# EAGLE design relay_pwm (EAGLE 6.4)
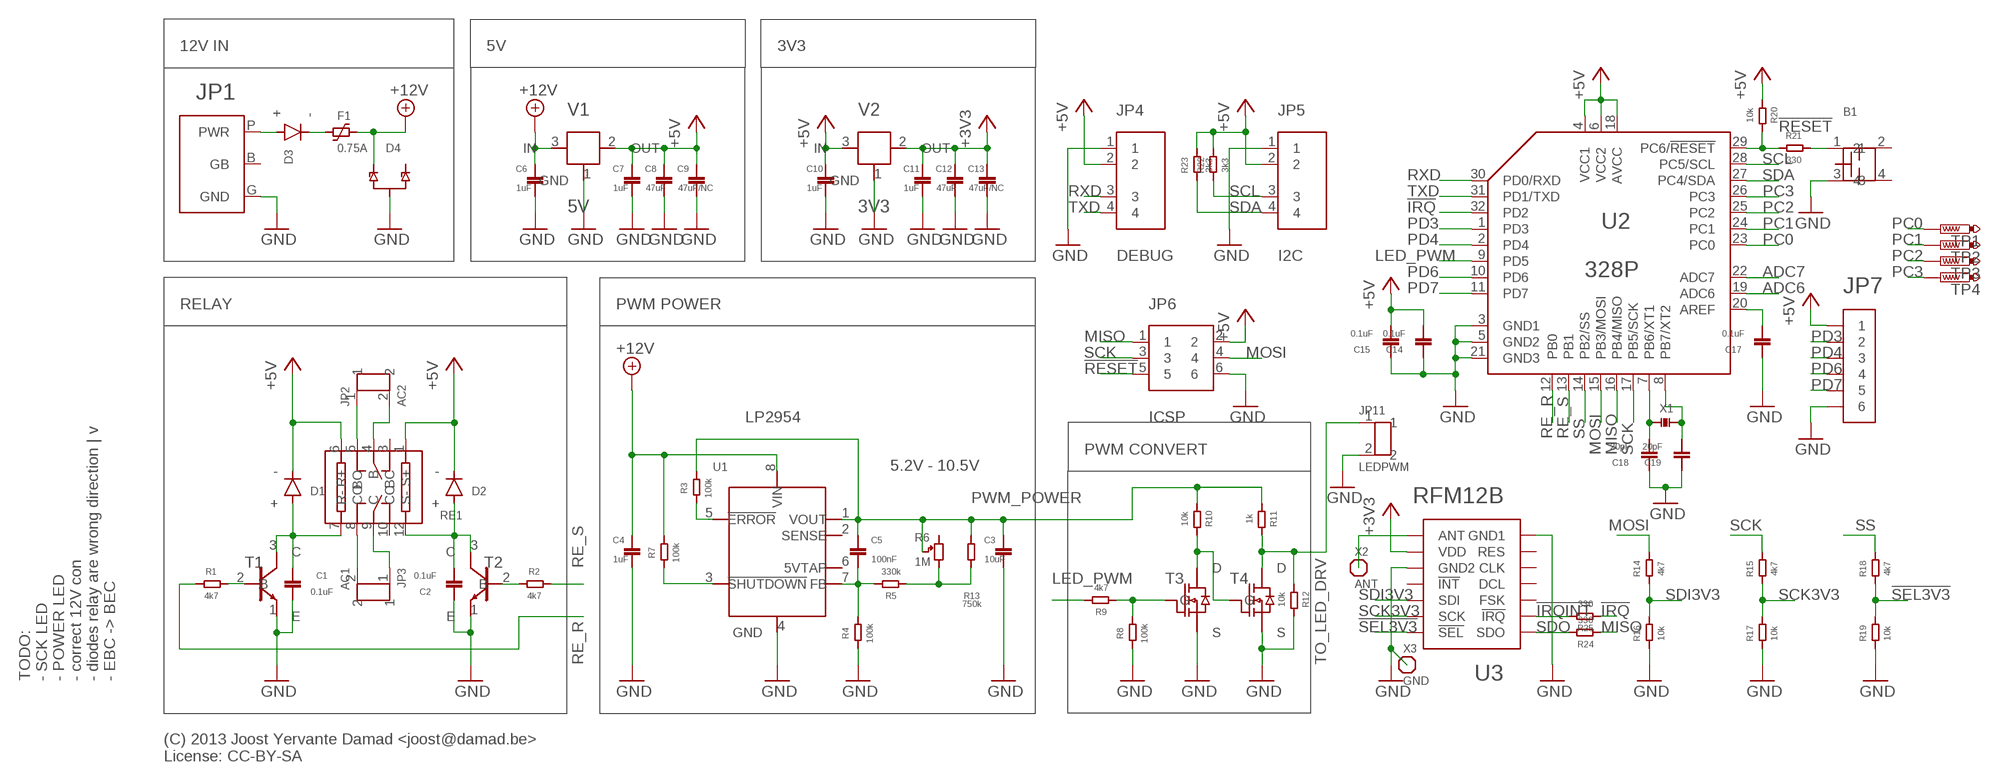
[diagram p0: schematic, sheet 1]

## Parts
B1  BUTTON_ALPS_5.2MM_SMD  [BUTTON_ALPS_SMD_5.2MM_SKQG]
C1  0.1uF  C0603  [0603@1]
C2  0.1uF  C0603  [0603@1]
C3  10uF  CAPACITOR1206  [1206]
C4  1uF  CAPACITOR0603  [0603]
C5  100nF  CAPACITOR0603  [0603]
C6  1uF  CAPACITOR0603  [0603]
C7  1uF  CAPACITOR0603  [0603]
C8  47uF  CAPACITOR1206  [1206]
C9  47uF/NC  CAPACITOR1206  [1206]
C10  1uF  CAPACITOR0603  [0603]
C11  1uF  CAPACITOR0603  [0603]
C12  47uF  CAPACITOR1206  [1206]
C13  47uF/NC  CAPACITOR1206  [1206]
C14  0.1uF  C0603  [0603@1]
C15  0.1uF  C0603  [0603@1]
C17  0.1uF  C0603  [0603@1]
C18  20pF  C0603  [0603@1]
C19  20pF  C0603  [0603@1]
D1  DIODE  [TAIW_SEM_DIODE]
D2  DIODE  [TAIW_SEM_DIODE]
D3  DIODE  [TAIW_SEM_DIODE]
D4  DUAL_TVSSOT-23  [SOT-23]
F1  0.75A  TE_POLYFUSE_1812  [TE_POLYFUSE_1812]
JP1  POWER_PLUG_2.1MM  [POWER_PLUG_2.1MM]
JP2  AC2  WAGO500-2PIN  [WAGO_500_SCREW_TERMINAL_2_PIN]
JP3  AC1  WAGO500-2PIN  [WAGO_500_SCREW_TERMINAL_2_PIN]
JP4  DEBUG  PIN1X4PTH2.54  [PIN_1X4]
JP5  I2C  PIN1X4JSTSIDE  [JST-S-4B-XH-A]
JP6  ICSP  PIN2X32X3ALT  [PIN_2X3_ALT]
JP7  PIN1X6  [PIN_1X6]
JP11  LEDPWM  WAGO500-2PIN  [WAGO_500_SCREW_TERMINAL_2_PIN]
R1  4k7  RESISTOR0603  [0603]
R2  4k7  RESISTOR0603  [0603]
R3  100k  RESISTOR0603  [0603]
R4  100k  RESISTOR0603  [0603]
R5  330k  RESISTOR0603  [0603]
R6  1M  TRIMMER  [SMT_TRIMMER_PANASONIC_EVM3Y]
R7  100k  RESISTOR0603  [0603]
R8  100k  RESISTOR0603  [0603]
R9  4k7  RESISTOR0603  [0603]
R10  10k  RESISTOR0603  [0603]
R11  1k  RESISTOR0603  [0603]
R12  10k  RESISTOR0603  [0603]
R13  750k  RESISTOR0603  [0603]
R14  4k7  RESISTOR0603  [0603]
R15  4k7  RESISTOR0603  [0603]
R16  10k  RESISTOR0603  [0603]
R17  10k  RESISTOR0603  [0603]
R18  4k7  RESISTOR0603  [0603]
R19  10k  RESISTOR0603  [0603]
R20  10k  RESISTOR0603  [0603]
R21  330  RESISTOR0603  [0603]
R22  3k3  RESISTOR0603  [0603]
R23  3k3  RESISTOR0603  [0603]
R24  330  RESISTOR0603  [0603]
R25  330  RESISTOR0603  [0603]
RE1  RELAY_TE_V23079_THT_STD_2C  [RELAY_TE_V23079_THT_STANDARD_BISTABLE_2_COIL]
T1  TRANSISTOR-BJT-NPNEBC  [SOT-23]
T2  TRANSISTOR-BJT-NPNEBC  [SOT-23]
T3  MOSFET-N-ENHGSD  [SOT-23]
T4  MOSFET-N-ENHGSD  [SOT-23]
TP1  PTR1B1,27  [B1,27]
TP2  PTR1B1,27  [B1,27]
TP3  PTR1B1,27  [B1,27]
TP4  PTR1B1,27  [B1,27]
U1  LP2954  [TI_LP2954_SO8]
U2  328P  ATMEGA328PTQFP32  [TQFP32]
U3  RFM12B  [RFM12B]
V1  5V  VREG_MCP1703  [SOT-23A]
V2  3V3  VREG_MCP1703  [SOT-23A]
X1  CRYSTAL  [CRYSTAL_2-PAD_5X3.2MM]
X2  ANT  PIN1X1  [PIN_1X1]
X3  GND  PIN1X1  [PIN_1X1]

## Nets
!IRQ: R25.1 U2.32(PD2)
!IRQINT: R25.2 U3.NIRQ(!IRQ)
!RESET: JP6.5 R20.2 R21.1 U2.29(PC6/!RESET)
!SEL3V3: R18.1 R19.2 U3.NSEL(!SEL)
+3V3: C11.2 C12.1 C13.1 U3.VDD V2.2(OUT)
+5V: C7.2 C8.1 C9.1 C10.2 C14.1 C15.1 D1.- D2.- JP4.2 JP5.2 JP6.2 JP7.1 R20.1 R22.2 R23.2 RE1.1(S+) RE1.6(R+) U2.4(VCC1) U2.6(VCC2) U2.18(AVCC) V1.2(OUT) V2.3(IN)
+12V: C4.2 C6.2 D4.1 F1.2 R7.2 U1.8(VIN) V1.3(IN)
ADC6: U2.19(ADC6)
ADC7: U2.22(ADC7)
GND: B1.3 C1.1 C2.2 C3.2 C4.1 C6.1 C7.1 C8.2 C9.2 C10.1 C11.1 C12.2 C13.2 C14.2 C15.2 C17.2 C18.2 C19.2 D4.3(G1) JP1.G(GND) JP4.1 JP5.1 JP6.6 JP7.6 JP11.2 R4.1 R8.1 R12.2 R16.1 R17.1 R19.1 T1.1(E) T2.1(E) T3.2(S) T4.2(S) U1.4(GND) U2.3(GND1) U2.5(GND2) U2.21(GND3) U3.GND@1(GND1) U3.GND@2(GND2) V1.1(GND) V2.1(GND) X3.1
LED_PWM: R9.2 U2.9(PD5)
LED_PWM_INT: R8.2 R9.1 T3.1(G)
LP2954_ER: R3.1 U1.5(!ERROR)
LP2954_FB: C5.1 R4.2 R5.2 U1.7(FB)
LP2954_SH: R7.1 U1.3(!SHUTDOWN)
MISO: JP6.1 R24.1 U2.16(PB4/MISO)
MOSI: JP6.4 R14.2 U2.15(PB3/MOSI)
N$1 [high power]: JP2.1 RE1.5(BO)
N$2 [high power]: JP2.2 RE1.4(B)
N$3 [high power]: JP3.2 RE1.8(CO)
N$4 [high power]: JP3.1 RE1.9(C)
N$7: C2.1 D2.+ RE1.12(S-) T2.3(C)
N$8: R10.2 T3.3(D) T4.1(G)
N$9: R5.1 R6.C R13.1
N$10: R2.1 T2.2(B)
N$11: D3.+ JP1.P(PWR)
N$12: D3.- F1.1
N$13: U3.ANT X2.1
N$14: C17.1 U2.20(AREF)
N$16: B1.1 R21.2
N$17: C18.1 U2.7(PB6/XT1) X1.1
N$18: C19.1 U2.8(PB7/XT2) X1.2
PC0: TP1.TP U2.23(PC0)
PC1: TP2.TP U2.24(PC1)
PC2: TP3.TP U2.25(PC2)
PC3: TP4.TP U2.26(PC3)
PD3: JP7.2 U2.1(PD3)
PD4: JP7.3 U2.2(PD4)
PD6: JP7.4 U2.10(PD6)
PD7: JP7.5 U2.11(PD7)
PWM_POWER: C3.1 C5.2 R3.2 R6.B R10.1 R11.1 R13.2 U1.1(VOUT)
RE_R: R1.1 U2.12(PB0)
RE_S: R2.2 U2.13(PB1)
RXD: JP4.3 U2.30(PD0/RXD)
SCK: JP6.3 R15.2 U2.17(PB5/SCK)
SCK3V3: R15.1 R17.2 U3.SCK
SCL: JP5.3 R22.1 U2.28(PC5/SCL)
SDA: JP5.4 R23.1 U2.27(PC4/SDA)
SDI3V3: R14.1 R16.2 U3.SDI
SDO: R24.2 U3.SDO
SS: R18.2 U2.14(PB2/SS)
T1B: R1.2 T1.2(B)
T1C: C1.2 D1.+ RE1.7(R-) T1.3(C)
TO_LED_DRV: JP11.1 R11.2 R12.1 T4.3(D)
TXD: JP4.4 U2.31(PD1/TXD)
Unconnected: B1.2 B1.4 D4.2 JP1.B(GB) R6.A RE1.3(BC) RE1.10(CC) U1.2(SENSE) U1.6(5VTAP) U3.CLK U3.DCL U3.FSK U3.NINT(!INT) U3.RES

## Notes on the sheet
- 12V IN | 5V | 3V3
- RELAY | PWM POWER
- LP2954
- PWM CONVERT
- 5.2V - 10.5V
- TODO: 
  - SCK LED
  - POWER LED
  - correct 12V con
  - diodes relay are wrong direction | v
  - EBC -> BEC
- (C) 2013 Joost Yervante Damad <joost@damad.be>
  License: CC-BY-SA

## Library data of the parts
B1 = 01jyd:BUTTON_ALPS_5.2MM_SMD
C1 C2 C14 C15 C17-C19 = 01jyd:C0603
C3-C13 = 01jyd:CAPACITOR
D1-D3 = 01jyd:DIODE
D4 = 01jyd:DUAL_TVS
F1 = 01jyd:TE_POLYFUSE_1812
JP1 = 01jyd:POWER_PLUG_2.1MM
JP2 JP3 JP11 = 01jyd:WAGO500-2PIN
JP4 JP5 = 01jyd:PIN1X4
JP6 = 01jyd:PIN2X3
JP7 = 01jyd:PIN1X6
R1-R5 R7-R25 = 01jyd:RESISTOR
R6 = 01jyd:TRIMMER
RE1 = 01jyd:RELAY_TE_V23079_THT_STD_2C
T1 T2 = 01jyd:TRANSISTOR-BJT-NPN
T3 T4 = 01jyd:MOSFET-N-ENH
TP1-TP4 = testpad:PTR1: TEST PIN
U1 = 01jyd:LP2954
U2 = 01jyd:ATMEGA328P
U3 = 01jyd:RFM12B
V1 V2 = 01jyd:VREG_MCP1703
X1 = 01jyd:CRYSTAL
X2 X3 = 01jyd:PIN1X1

## Net classes
1 high power: width 1 mm

## Board
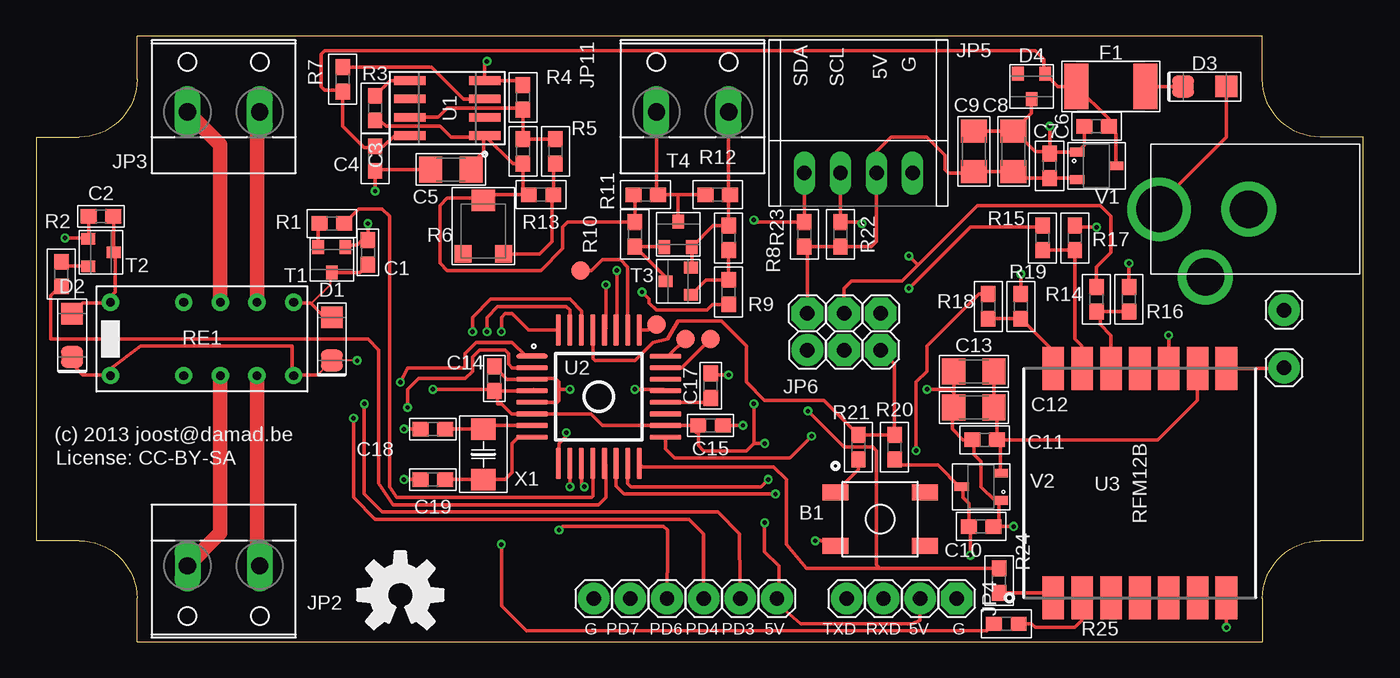
[diagram p1: board, top side]
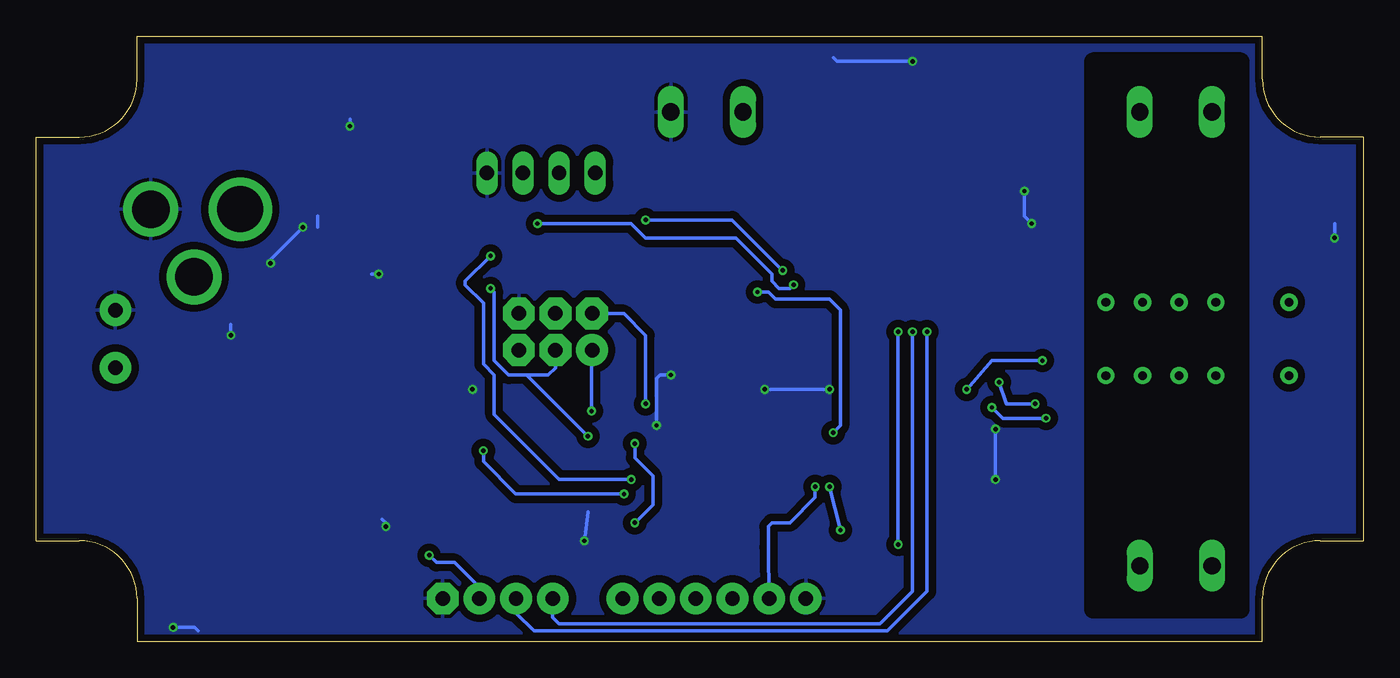
[diagram p2: board, bottom side, seen from below]

Size 92 x 42 mm. Coordinates in mm from the lower left corner, seen from the top.
Outline: 7,0 85,0 85,3 arc-90 89,7 92,7 92,35 89,35 arc-90 85,39 85,42 7,42 7,39 arc-90 3,35 0,35 0,7 3,7 arc-90 7,3 7,0
Copper layers (1*2*15*16): Top 0.035mm / dielectric 0.2mm / Route2 0.0175mm / dielectric 1.1mm / Route15 0.0175mm / dielectric 0.2mm / Bottom 0.035mm
Design rules "SeeedStudio_DRU_no_angle_20130527": minimum track width 6mil, minimum drill 12mil, track to track 6mil, track to pad 6mil, pad to pad 6mil, via to via 6mil, smd to smd 0mil, copper to edge 10mil, drill to drill 10mil, minimum pad ring 6mil, minimum via ring 6mil, stop-mask expansion 2mil, vias tented up to drill 25mil, thermal gap 10mil
bRestrict: 4 lines

### Footprints (pad centres in the part's own frame; a part is rotated, then mirrored left to right if it is on the bottom)
BUTTON_ALPS_SMD_5.2MM_SKQG = smd 1.8 x 1.1: 1 -3.1,1.85; 2 3.1,1.85; 3 -3.1,-1.85; 4 3.1,-1.85
0603@1 = smd 1.1 x 1: 1 -0.85,0; 2 0.85,0
1206 = smd 1.6 x 1.8: 1 -1.4,0; 2 1.4,0
0603 = smd 1.1 x 1: 1 -0.85,0; 2 0.85,0
TAIW_SEM_DIODE = smd 1.5 x 1.5: + 1.5,0; - -1.5,0
SOT-23 = smd 0.802 x 0.972: 1 -0.95,-0.885; 2 0.95,-0.885; 3 0,0.885
TE_POLYFUSE_1812 = smd 1.68 x 3.15: 1 -2.39,0; 2 2.39,0
POWER_PLUG_2.1MM = drill 2.6 pad 3.8: B 3.45,4.7; G 0.45,0 | drill 3.2 pad 4.4: P 6.65,0
WAGO_500_SCREW_TERMINAL_2_PIN = drill 1.2 long: 1 -2.5,-1.27; 2 2.5,-1.27
PIN_1X4 = drill 1 pad 2.2 octagon: 1 0,3.81 | drill 1 pad 2.2: 2 0,1.27; 3 0,-1.27; 4 0,-3.81
JST-S-4B-XH-A = drill 1 long: 1 3.75,0; 2 1.25,0; 3 -1.25,0; 4 -3.75,0
PIN_2X3_ALT = drill 1 pad 2.2: 1 -1.27,2.54 | drill 1 pad 2.2 octagon: 2 1.27,2.54; 3 -1.27,0; 4 1.27,0; 5 -1.27,-2.54; 6 1.27,-2.54
PIN_1X6 = drill 1 pad 2.2: 1 0,6.35; 2 0,3.81; 3 0,1.27; 4 0,-1.27; 5 0,-3.81; 6 0,-6.35
SMT_TRIMMER_PANASONIC_EVM3Y = smd 1.2 x 1.2: A -1.4,-1.6; C 1.4,-1.6 | smd 1.6 x 1.5: B 0,2.1
RELAY_TE_V23079_THT_STANDARD_BISTABLE_2_COIL = drill 0.6 pad 1.2: 1 -6.35,-2.54; 3 -1.27,-2.54; 4 1.27,-2.54; 5 3.81,-2.54; 6 6.35,-2.54; 7 6.35,2.54; 8 3.81,2.54; 9 1.27,2.54; 10 -1.27,2.54; 12 -6.35,2.54
B1,27 = smd 1.27 x 1.27: TP 0,0
TI_LP2954_SO8 = smd 2.2 x 0.6: 1 -2.6,1.905; 2 -2.6,0.635; 3 -2.6,-0.635; 4 -2.6,-1.905; 5 2.6,-1.905; 6 2.6,-0.635; 7 2.6,0.635; 8 2.6,1.905
TQFP32 = smd 2.17 x 0.36: 1 -4.625,2.8; 2 -4.625,2; 3 -4.625,1.2; 4 -4.625,0.4; 5 -4.625,-0.4; 6 -4.625,-1.2; 7 -4.625,-2; 8 -4.625,-2.8; 17 4.625,-2.8; 18 4.625,-2; 19 4.625,-1.2; 20 4.625,-0.4; 21 4.625,0.4; 22 4.625,1.2; 23 4.625,2; 24 4.625,2.8 | smd 0.36 x 2.17: 9 -2.8,-4.625; 10 -2,-4.625; 11 -1.2,-4.625; 12 -0.4,-4.625; 13 0.4,-4.625; 14 1.2,-4.625; 15 2,-4.625; 16 2.8,-4.625; 25 2.8,4.625; 26 2,4.625; 27 1.2,4.625; 28 0.4,4.625; 29 -0.4,4.625; 30 -1.2,4.625; 31 -2,4.625; 32 -2.8,4.625
RFM12B = smd 3 x 1.5: ANT 7.95,-6; CLK -7.95,-2; DCL -7.95,0; FSK -7.95,2; GND@1 -7.95,-6; GND@2 7.95,-2; NINT 7.95,0; NIRQ -7.95,4; NSEL 7.95,6; RES -7.95,-4; SCK 7.95,4; SDI 7.95,2; SDO -7.95,6; VDD 7.95,-4
SOT-23A = smd 0.6 x 1: 1 -0.95,-1.35; 2 0.95,-1.35; 3 0,1.35
CRYSTAL_2-PAD_5X3.2MM = smd 1.5 x 1.7: 1 -1.75,0; 2 1.75,0
PIN_1X1 = drill 1 pad 2.2: 1 0,0

### Placement (x,y rotation side)
B1  58.5,8.5 0 top
C1  23,27 270 top
C2  4.5,29.5 180 top
C3  28.75,32.75 180 top
C4  23.5,33.5 90 top
C5  33.75,34 270 top
C6  73.5,35.75 0 top
C7  70.25,33 270 top
C8  67.75,34 90 top
C9  65,34 90 top
C10  65.5,8 180 top
C11  65.75,14 0 top
C12  65,16.25 180 top
C13  65,18.75 180 top
C14  31.75,18.25 90 top
C15  46.75,15 0 top
C17  46.75,17.75 90 top
C18  27.5,14.75 180 top
C19  27.5,11.25 180 top
D1  20.5,21 90 top
D2  2.5,21.25 90 top
D3  81,38.5 0 top
D4  69,38.5 180 top
F1  74.5,38.5 180 top
JP1  84.5,30 180 top
JP2  13,4 180 top
JP3  13,38 0 top
JP4  60,3 270 top
JP5  57,32.5 0 top
JP6  56,21.5 90 top
JP7  45,3 270 top
JP11  45.5,38 0 top
R1  20.5,29 180 top
R2  1.75,25.5 270 top
R3  23.5,37 270 top
R4  33.75,37.75 270 top
R5  36,34 90 top
R6  31,28.5 0 top
R7  21.25,39 270 top
R8  48,28 270 top
R9  48,24.25 270 top
R10  41.5,28.25 270 top
R11  42.25,31 0 top
R12  47.25,31 0 top
R13  35,31 180 top
R14  73.5,23.75 90 top
R15  69.75,28 90 top
R16  75.75,23.75 270 top
R17  72,28 270 top
R18  66,23.25 90 top
R19  68.25,23.25 270 top
R20  59.5,13.5 90 top
R21  57,13.5 270 top
R22  55.75,28.25 270 top
R23  53.25,28.25 270 top
R24  66.75,4.25 270 top
R25  67.25,1.25 0 top
RE1  11.5,21 0 top
T1  20.5,26.5 180 top
T2  4.5,27 270 top
T3  44.5,25 90 top
T4  44.5,28.25 0 top
TP1  46.75,21 0 top
TP2  45,21 0 top
TP3  43,22 0 top
TP4  37.75,25.75 0 top
U1  28.5,37 180 top
U2  39,17 0 top
U3  76.5,11 90 top
V1  73.5,33 270 top
V2  65.5,10.75 90 top
X1  31,13 270 top
X2  86.5,19 0 top
X3  86.5,23 0 top

### Tracks (layer width: path | path; a pad name or v marks a point on that pad's centre or on a via)
!IRQ  (via drill 0.3)
  Top 0.25: U2.32 34.12,21.62 33,22.75 32.5,22.75 32.25,22.5 v32.25,21.5 | v32.25,6.75 32.25,2.5 34,0.75 65.9,0.75 R25.1
  Bottom 0.25: v32.25,21.5 v32.25,6.75
!IRQINT
  Top 0.25: R25.2 69,1.25 69.25,1 72,1 72.5,1.5 U3.NIRQ
!RESET
  Top 0.25: JP6.5 59.5,19.27 R20.2 R21.1 54.6,16.75 50.5,16.75 49.25,18 49.25,20.5 47.5,22.25 44.5,22.25 43.75,21 42.75,20.75 41.5,19.5 38.75,19.5 38.6,19.65 U2.29
!SEL3V3
  Top 0.25: U3.NSEL 70.5,20.15 R19.2 R18.1
+3V3
  Top 0.25: C11.2 77.75,14 80.5,16.75 U3.VDD | V2.2 66.85,13.75 C11.2 | C11.2 66.6,16.05 C12.1 C13.1
+5V  (via drill 0.3, 0.3 pad 0.3)
  Top 0.152: 2.5,19.25 2.5,19.62 D2.- | D1.- 19.5,18.5 | D1.- 22.12,19.5 v22.25,19.5 | D1.-
  Top 0.2: 53,1.25 52,2.1 JP7.1
  Top 0.25: 2.5,19.25 | 2.5,19.25 3.25,18.5 5.11,18.5 RE1.1 5.15,18.9 7.25,20.5 17.75,20.5 17.75,18.56 RE1.6 17.89,18.5 19.5,18.5 | 19.5,18.5 | C14.1 U2.4 34.48,17.5 | C14.1 32,17.15 32,16.5 32.25,16.5 32.95,15.8 U2.6 38.45,15.8 39.25,15 U2.18 C15.1 | V1.2 72.05,32.15 C7.2 68.2,32.15 C8.1 C9.1 64.9,32.5 63.25,32.5 63,32.75 63,33.75 61.75,35 59.25,35 58.25,34 JP5.2 58.25,27.75 57.9,27.4 R22.2 R23.2 53.46,27.19 JP6.2 53.44,22.75 | R20.1 59.9,12.25 62.5,12.25 64,10.75 V2.3 64.25,10.65 64.25,10 64.65,9.6 C10.2 64.75,7.9 v64.75,6 | 53,1.25 60.75,1.25 61.25,1.5 61.25,2.98 JP4.2 | 46,14.9 C15.1 | 31.6,17.25 C14.1 | v27.5,17.5 31.65,17.5 C14.1 | 45.75,14.5 45.75,14.85 C15.1 | C15.1 45.9,13.6 46.25,13.25 49.25,13.25 49.75,13.75 | 49.75,13.75 v49.75,16.5 | 49.75,13.75 v50.5,13.75 | v50.5,8.25 50.5,6.25 51.5,5.25 51.5,2.9 JP7.1
  Bottom 0.25: v27.5,17.5 25.75,19.5 v22.25,19.5 | JP4.2 61.27,3.77 63,5.5 64.25,5.5 v64.75,6 | v49.75,16.5 49.75,21.25 51.25,22.75 53.44,22.75 JP6.2 | v50.5,13.75 50.5,12.75 49.25,11.5 49.25,9.5 v50.5,8.25
+12V
  Top 0.2: 23.5,34.25 C4.2
  Top 0.25: U1.8 24.84,35.09 24.1,34.35 C4.2 | 23.5,34.25 22.75,34.25 21.25,35.75 R7.2 21.15,38.25 20,38.25 19.75,38.5 19.75,40.75 20,41 69.25,41 69.86,40.38 69.86,39.38 D4.1 70.83,38.5 F1.2 74.35,36.26 C6.2 74.85,35.25 V1.3
GND  (via drill 0.3, 0.3 pad 0.3)
  Top 0.25: T1.1 21.57,27.5 22.25,27.5 22.6,27.85 C1.1 v23,29 | C2.2 3.65,27.98 | 3.65,27.98 T2.1 | 3.65,27.98 2.02,27.98 v2,28 | C19.2 v25.5,11.25 | v25.5,14.75 C18.2 | C14.2 32.65,18.2 U2.3 34.42,18.25 36,18.25 36.25,18 36.25,17.5 | U2.5 36.1,16.6 36.25,16.75 36.25,17.5 | 36.25,17.5 v37,17.5 | v41.5,17.5 43.52,17.5 U2.21 | C15.2 v49,15 | v48,18.5 46.85,18.5 C17.2 | R4.1 33.45,38.91 U1.4 31.1,40.1 v31.25,40.25 | v23.5,31.25 C4.1 23.6,32.75 C3.2 | C7.1 v70.25,35.75 | C6.1 72.65,34.45 V1.1 70.35,33.95 C7.1 | C8.2 67.85,35.4 69.25,34 70.1,34 C7.1 | D4.3 69,36.65 C8.2 | C8.2 C9.2 | U3.GND@2 v78.5,21.25 | R16.1 v75.75,26.25 | v73.5,28.75 72.1,28.75 R17.1 | R19.1 v68.25,25.5 | U3.GND@1 v82.5,1 | V2.1 66.45,9.8 65.5,10.75 65.5,12.5 65,13 65,13.9 C11.1 64.25,14 63.5,14.75 63.5,16.15 C12.2 63.6,17.25 | 63.6,17.25 C13.2 | v61.75,17.5 63.35,17.5 63.6,17.25 | C10.1 66.75,8 | 66.75,8 v67.75,8 | 66.75,8 66.75,9.75 | B1.3 54.15,7.1 v54,7 | 48,31 JP11.2 | R12.2 48,31 | 48,31 R8.1 46.94,28.85 T4.2 45.45,26.02 T3.2
  Bottom 0.25: v2,28 2,29 | v25.5,11.25 v25.5,14.75 | v37,17.5 v41.5,17.5 | v49,15 49,18.25 48.75,18.5 v48,18.5 | v31.25,40.25 36.5,40.25 36.75,40.5 | v23.5,31.25 23.5,29.5 v23,29 | v70.25,35.75 70.25,36.25 | 72.5,28.75 72.5,29.5 | v78.5,21.25 78.5,22 | v75.75,26.25 75.75,26.5 v73.5,28.75 | v68.25,25.5 68.75,25.5 | v82.5,1 81,1 80.75,0.75 | v67.75,8 67.75,8.25 68,8.5 | v54,7 53.75,9
  pour Bottom (isolate 0.5): 0,42 92,42 92,0 0,0
LED_PWM  (via drill 0.3)
  Top 0.25: R9.2 46.9,23.4 46.5,23 43,23 42.5,23.5 42.5,23.75 v42,24.25 | v36.75,14.5 36.75,14.25 36.25,13.75 36.25,12.43 U2.9
  Bottom 0.25: v42,24.25 41.25,24.25 40.75,23.75 37,23.75 36.25,23 36.25,15 v36.75,14.5
LED_PWM_INT
  Top 0.25: R8.2 R9.1 46.44,25.1 T3.1
LP2954_ER
  Top 0.25: U1.5 24.55,38.91 R3.1
LP2954_FB
  Top 0.25: R5.2 C5.1 R4.2 33.65,37 28.5,37 27.86,36.37 U1.7
LP2954_SH
  Top 0.25: U1.3 29.61,37.63 27.4,39.85 R7.1
MISO  (via drill 0.3)
  Top 0.25: R24.1 58.5,5.1 | 58.5,5.1 53.4,5.1 52,6.75 52,11.25 51.12,12.12 42.05,12.12 U2.16 | 58.5,5.1 58.25,5.35 58.25,13.25 58,13.5 56,13.5 v53.5,16
  Bottom 0.25: v53.5,16 53.5,20.19 JP6.1
MOSI  (via drill 0.3)
  Top 0.25: JP6.4 56,24.5 56.5,25 60,25 61.12,26.12 | 61.12,26.12 65.25,30.25 73.75,30.25 74.5,29.5 74.5,27 73.5,26 R14.2 | U2.15 41,11 41.25,10.75 50.25,10.75 v50.75,11.25 | v60.5,26.75 61.12,26.12
  Bottom 0.25: v50.75,11.25 55.75,11.25 60.25,15.75 60.25,18.5 61,19.25 61,23.5 62.25,24.75 62.25,25 v60.5,26.75
N$1
  Top 1: RE1.5 15.31,5.46 JP2.1
N$2
  Top 1: RE1.4 12.77,7.54 JP2.2
N$3
  Top 1: RE1.8 15.31,36.54 JP3.2
N$4
  Top 1: RE1.9 12.77,34.46 JP3.1
N$7
  Top 0.25: D2.+ 3.25,23.5 5.11,23.5 RE1.12 5.15,23.9 5.5,24.25 5.5,26.89 T2.3 5.38,29.46 C2.1
N$8
  Top 0.25: T3.3 43.62,25.29 R10.2 43.52,27.4 T4.1
N$9
  Top 0.25: R5.1 35.85,33 R13.1 35.75,30.9 35.75,27.75 34.9,26.9 R6.C
N$10
  Top 0.25: T2.2 2.05,26.05 R2.1
N$11
  Top 0.25: JP1.P 77.85,30.35 82.5,35 D3.+
N$12
  Top 0.25: D3.- F1.1
N$13
  Top 0.25: U3.ANT 86.45,18.95 X2.1
N$14
  Top 0.25: U2.20 46.45,16.6 C17.1
N$15
  Top 0.2: 26.04,1.34 arc9 26.34,1.5 27.1,0.89 27.61,1.4 27,2.16 arc19 27.26,2.79 28.23,2.88 28.23,3.62 27.26,3.71 arc19 27,4.34 27.61,5.1 27.1,5.61 26.34,5 arc19 25.71,5.26 25.62,6.23 24.88,6.23 24.79,5.26 arc19 24.16,5 23.4,5.61 22.89,5.1 23.5,4.34 arc19 23.24,3.71 22.27,3.62 22.27,2.88 23.24,2.79 arc19 23.5,2.16 22.89,1.4 23.4,0.89 24.16,1.5 arc9 24.46,1.34 24.89,2.38 arc-68 24.31,3.25 arc-248 25.61,2.38 26.04,1.34
N$16
  Top 0.25: R21.2 57,11.95 B1.1
N$17
  Top 0.25: U2.7 31.25,15 X1.1 C18.1
N$18
  Top 0.25: U2.8 33.45,14.2 33,13.75 33,11.75 32.5,11.25 X1.2 C19.1
PC0
  Top 0.25: U2.23 44.75,19 TP1.TP
PC1
  Top 0.25: U2.24 43.8,19.8 TP2.TP
PC2
  Top 0.25: U2.25 42.38,21.62 TP3.TP
PC3
  Top 0.25: TP4.TP 38.5,25.75 39.25,26.5 40.5,26.5 41,26 U2.26
PD3  (via drill 0.3 pad 0.3)
  Top 0.25: U2.1 33.95,19.8 33,20.75 30.5,20.75 29.75,20 29.75,19 25.75,19 v25.25,18 | JP7.2 48.75,6.56 48.75,7.5 47.25,9 24,9 22.75,10.25 v22.75,16.5
  Bottom 0.25: v22.75,16.5 24.75,16.5 v25.25,18
PD4  (via drill 0.3 pad 0.3)
  Top 0.25: U2.2 33,19 32.75,19.25 32.75,20 32.5,20.25 30.75,20.25 30.25,19.75 30.25,18.75 29.75,18.25 26.5,18.25 25.75,17.5 v25.75,16.25 | JP7.3 46.27,7.48 45.25,8.5 23.5,8.5 22,10 v22,15.5
  Bottom 0.25: v25.75,16.25 25,15.5 v22,15.5
PD6  (via drill 0.3)
  Top 0.25: U2.10 v37,10.75 | JP7.4 43.75,6.52 43.75,7.75 43.5,8 36.5,8 v36.25,7.75
  Bottom 0.25: v37,10.75 v36.25,7.75
PD7  (via drill 0.3)
  Top 0.25: U2.11 37.8,10.95 v38,10.75
  Bottom 0.25: v38,10.75 38,10 39.75,8.25 41,8.25 41.25,8 41.25,6.56 JP7.5
PWM_POWER
  Top 0.25: U1.1 33.05,33.15 C5.2 33.75,31.4 R13.2 31.4,31 R6.B 30.85,30.75 28.5,30.75 28,30.25 28,26.25 28.5,25.75 35,25.75 36.5,27.25 36.5,28.75 36.85,29.1 R10.1 41.5,30.9 R11.1 | R3.2 23.85,36.15 24.25,35.75 28,35.75 28.75,35 31,35 U1.1 | C3.1 30.15,33.15 31,34 31,34.99 U1.1
RE_R
  Top 0.25: U2.12 38.6,10.1 38.5,10 25,10 24.5,10.75 24.5,29.5 24,30 22.35,30 R1.1
RE_S
  Top 0.25: R2.2 1.65,24.65 1,24 1,21 23,21 23.75,20.25 23.75,11 24.75,9.5 39,9.5 39.5,10 39.5,12.28 U2.13
RXD  (via drill 0.3)
  Top 0.25: U2.30 37.8,22.95 37,23.75 31.5,23.75 30.25,22.5 v30.25,21.5
  Bottom 0.25: v30.25,21.5 30.25,3.5 33,0.75 57.5,0.75 58.73,1.98 JP4.3
SCK  (via drill 0.3)
  Top 0.25: v60.5,24.5 64.75,28.75 69.65,28.75 R15.2 | U2.17 43.62,13.38 44.25,12.75 52.25,12.75 v53.75,14.25
  Bottom 0.25: JP6.3 56,19 56.5,18.5 58,18.5 | 58,18.5 59.25,18.5 60.25,19.5 60.25,24.25 v60.5,24.5 | v53.75,14.25 58,18.5
SCK3V3
  Top 0.25: U3.SCK 72.5,20.5 72,21 R17.2 R15.1
SCL  (via drill 0.3)
  Top 0.25: JP5.3 R22.1 57.15,29.1 v57.25,29 | v39.5,24.75 39.5,21.73 U2.28
  Bottom 0.25: v57.25,29 50.75,29 49.75,28 43.5,28 41,25.5 41,25 40.5,24.5 39.75,24.5 v39.5,24.75
SDA  (via drill 0.3)
  Top 0.25: JP5.4 R23.1 49.9,29.1 v49.75,29.25 | v40.25,25.75 40.25,21.68 U2.27
  Bottom 0.25: v49.75,29.25 43.75,29.25 v40.25,25.75
SDI3V3
  Top 0.25: U3.SDI 74.5,21.25 73.75,22 73.75,22.65 R14.1 R16.2
SDO
  Top 0.25: R24.2 70.15,3.4 U3.SDO
SS  (via drill 0.3)
  Top 0.25: U2.14 40.2,10.8 40.75,10.25 v51.25,10.25 | R18.2 65.35,24.1 61.75,20.5 61.75,18.75 61,18 v61,13.25
  Bottom 0.25: v61,13.25 61,12.5 58.75,10.25 v51.25,10.25
T1B
  Top 0.25: T1.2 19.55,28.9 R1.2
T1C
  Top 0.152: 20,22.5 20.38,22.5 D1.+ | 19.06,23.44 20.38,24.75 20.38,25.5 T1.3
  Top 0.25: 20,22.5 | 20,22.5 19.06,23.44 19,23.5 17.89,23.5 RE1.7 | T1.3 22.46,25.61 C1.2
TO_LED_DRV
  Top 0.25: JP11.1 43,31 R11.2 44.5,31 | R12.1 44.5,31 | T4.3 44.5,31
TXD  (via drill 0.3)
  Top 0.25: U2.31 37,23 36.75,23.25 32,23.25 31.25,22.5 v31.25,21.5
  Bottom 0.25: v31.25,21.5 31.25,3.5 33.5,1.25 55.75,1.25 56.19,1.69 JP4.4

### Text on the board
tPlace: G | 5V | SDA | SCL | (c) 2013 joost@damad.be | License: CC-BY-SA | G | PD7 | PD6 | PD4 | PD3 | 5V | TXD | RXD | 5V | G